# Altium schematic sheet Dynamics_Sch.SchDoc
size A3; SheetNumber: 1; SheetTotal: 4
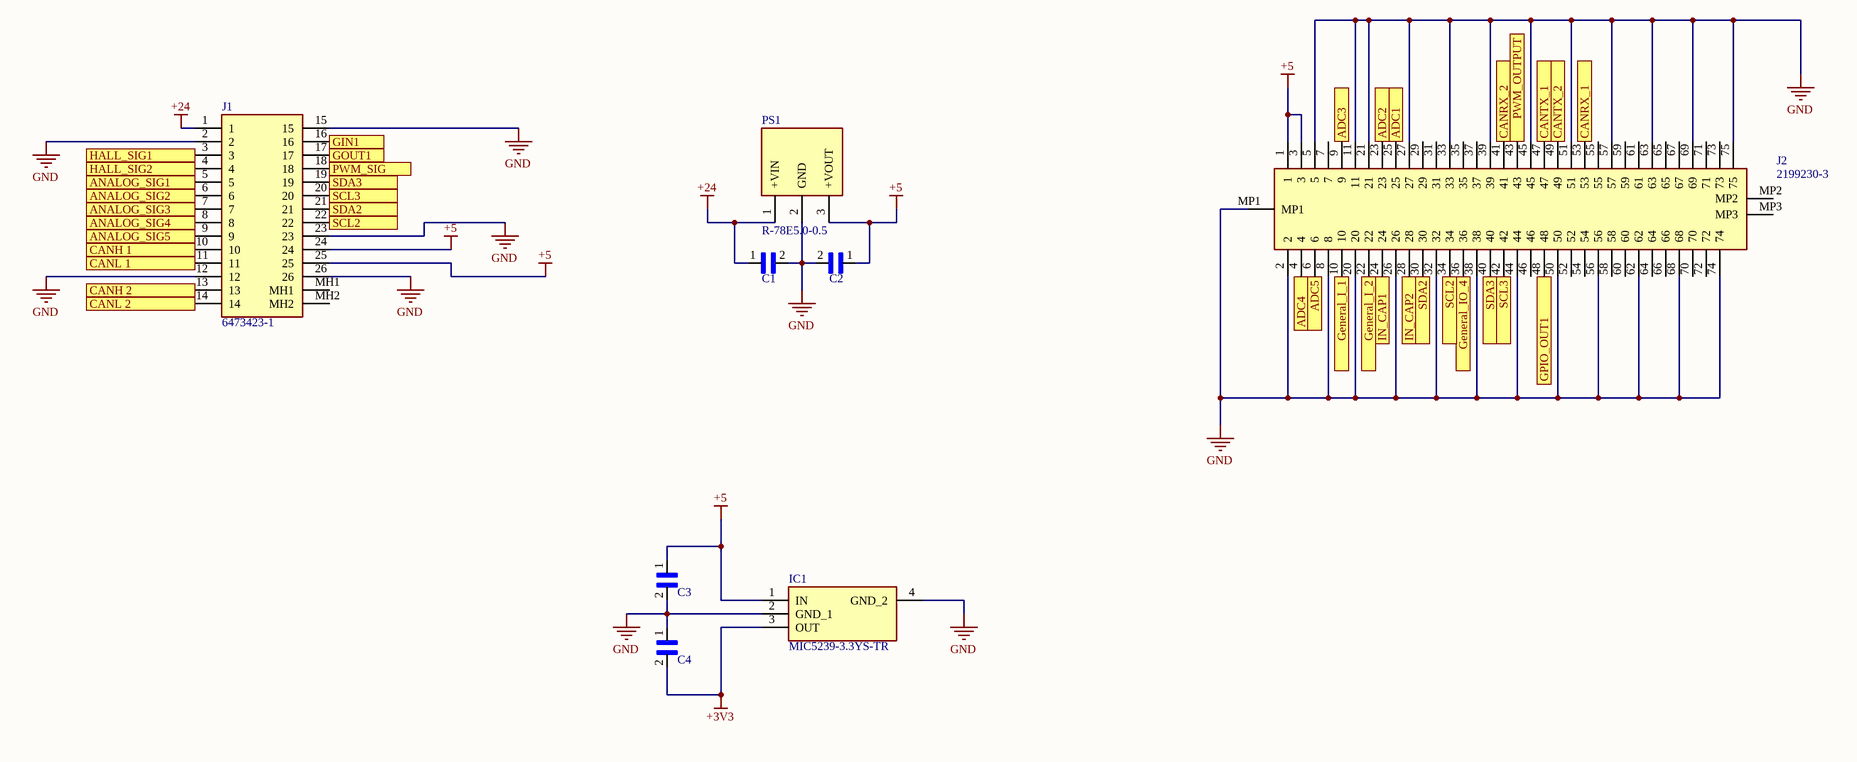
[diagram p0: Dynamics_Sch.SchDoc]

## Parts
C1  0805_Capacitor  [0805_Capacitor]  (value not drawn)
C2  0805_Capacitor  [0805_Capacitor]  (value not drawn)
C3  0805_Capacitor  [0805_Capacitor]  (value not drawn)
C4  0805_Capacitor  [0805_Capacitor]  (value not drawn)
IC1  MIC5239-3.3YS-TR  [SOT230P700X180-4N]
J1  6473423-1  [CONN26_6473423-1_TEC]
J2  2199230-3  [21992303]
PS1  R-78E5.0-0.5  [R78E5005]

## Ports
ADC1 (see Analog_Circuit[2A]), ADC2 (see Analog_Circuit[1C]), ADC3 (see Analog_Circuit[1D]), ADC4 (see Analog_Circuit[3A]), ADC5 (see Analog_Circuit[3B]), ANALOG_SIG1 (see Analog_Circuit[1A]), ANALOG_SIG2 (see Analog_Circuit[1C]), ANALOG_SIG3 (see Analog_Circuit[1D]), ANALOG_SIG4 (see Analog_Circuit[2A]), ANALOG_SIG5 (see Analog_Circuit[2B]), CANH 1 (see Communication[2A]), CANH 2 (see Communication[2B]), CANL 1 (see Communication[2A]), CANL 2 (see Communication[2B]), CANRX_1 (see Communication[2A]), CANRX_2 (see Communication[2B]), CANTX_1 (see Communication[2A]), CANTX_2 (see Communication[2B]), General_I_1 (see Analog_Circuit_1[1A]), General_I_2, General_IO_4, GIN1 (see Analog_Circuit_1[1A]), GOUT1 (see Analog_Circuit_1[2C]), GPIO_OUT1 (see Analog_Circuit_1[1C]), HALL_SIG1 (see Analog_Circuit[3B]), HALL_SIG2 (see Analog_Circuit[3C]), IN_CAP1 (see Analog_Circuit[4A]), IN_CAP2 (see Analog_Circuit[4C]), PWM_OUTPUT (see Analog_Circuit[2D]), PWM_SIG (see Analog_Circuit[3C]), SCL2 (see Dynamics_Sch[2B]), SCL2 (see Dynamics_Sch[7B]), SCL3 (see Dynamics_Sch[2B]), SCL3 (see Dynamics_Sch[7B]), SDA2 (see Dynamics_Sch[2B]), SDA2 (see Dynamics_Sch[6B]), SDA3 (see Dynamics_Sch[2B]), SDA3 (see Dynamics_Sch[7B])

## Nets
+3V3: C4.2 IC1.3(OUT)
+5: C2.1 C3.1 IC1.1(IN) J1.24 J1.25 J2.1 J2.3 PS1.3(+VOUT)
+24: C1.1 J1.1 PS1.1(+VIN)
GND: C1.2 C2.2 C3.2 C4.1 IC1.2(GND_1) IC1.4(GND_2) J1.2 J1.12 J1.15 J1.23 J1.26 J2.2 J2.5 J2.8 J2.11 J2.20 J2.21 J2.26 J2.27 J2.32 J2.33 J2.38 J2.39 J2.44 J2.45 J2.50 J2.51 J2.56 J2.57 J2.62 J2.63 J2.68 J2.69 J2.74 J2.75 J2.MP1 PS1.2(GND)
ADC1: J2.25 ; port ADC1
ADC2: J2.23 ; port ADC2
ADC3: J2.9 ; port ADC3
ADC4: J2.4 ; port ADC4
ADC5: J2.6 ; port ADC5
ANALOG_SIG1: J1.5 ; port ANALOG_SIG1
ANALOG_SIG2: J1.6 ; port ANALOG_SIG2
ANALOG_SIG3: J1.7 ; port ANALOG_SIG3
ANALOG_SIG4: J1.8 ; port ANALOG_SIG4
ANALOG_SIG5: J1.9 ; port ANALOG_SIG5
CANH 1: J1.10 ; port CANH 1
CANH 2: J1.13 ; port CANH 2
CANL 1: J1.11 ; port CANL 1
CANL 2: J1.14 ; port CANL 2
CANRX_1: J2.53 ; port CANRX_1
CANRX_2: J2.41 ; port CANRX_2
CANTX_1: J2.47 ; port CANTX_1
CANTX_2: J2.49 ; port CANTX_2
General_I_1: J2.10 ; port General_I_1
General_I_2: J2.22 ; port General_I_2
General_IO_4: J2.36 ; port General_IO_4
GIN1: J1.16 ; port GIN1
GOUT1: J1.17 ; port GOUT1
GPIO_OUT1: J2.48 ; port GPIO_OUT1
HALL_SIG1: J1.3 ; port HALL_SIG1
HALL_SIG2: J1.4 ; port HALL_SIG2
IN_CAP1: J2.24 ; port IN_CAP1
IN_CAP2: J2.28 ; port IN_CAP2
PWM_OUTPUT: J2.43 ; port PWM_OUTPUT
PWM_SIG: J1.18 ; port PWM_SIG
SCL2: J1.22 J2.34 ; port SCL2
SCL3: J1.20 J2.42 ; port SCL3
SDA2: J1.21 J2.30 ; port SDA2
SDA3: J1.19 J2.40 ; port SDA3

Not connected (* = marked no-connect by the designer): J1 MH1 MH2; J2 7 29 31 35 37 46 52 54 55 58 59 60 61 64 65 66 67 70 71 72 73 MP2 MP3

## Library data of the parts
C1-C4 = 0805_Capacitor: MP: CL21B104KBCNNNC; MF: Samsung; Availability: Unavailable; Package: 0805 Samsung; Value: *; Price: None; SnapEDA_Link: https://www.snapeda.com/parts/CL21B104KBCNNNC/Samsung/view-part/3597943/?ref=snap
IC1 = MIC5239-3.3YS-TR: Integrated Circuit; Manufacturer_Name: Microchip; Datasheet Link: https://ww1.microchip.com/downloads/en/DeviceDoc/mic5239.pdf; Height: 1.8mm; Manufacturer_Part_Number: MIC5239-3.3YS-TR; Mouser Part Number: 998-MIC5239-3.3YSTR; Mouser Price/Stock: https://www.mouser.co.uk/ProductDetail/Microchip-Technology-Micrel/MIC5239-33YS-TR?qs=U6T8BxXiZAXN0UitWWB92A%3D%3D; Arrow Part Number: MIC5239-3.3YS-TR; Arrow Price/Stock: https://www.arrow.com/en/products/mic5239-3.3ys-tr/microchip-technology?region=nac
J1 = 6473423-1: Connector; Manufacturer_Name: TE Connectivity; Datasheet Link: https://www.te.com/commerce/DocumentDelivery/DDEController?Action=showdoc&DocId=Customer+Drawing%7F9-1437287-8%7FA1%7Fpdf%7FEnglish%7FENG_CD_9-1437287-8_A1.pdf%7F6473423-1; Height: 27.9mm; Manufacturer_Part_Number: 6473423-1; Mouser Part Number: 571-6473423-1; Mouser Price/Stock: https://www.mouser.co.uk/ProductDetail/TE-Connectivity/6473423-1?qs=XhI5AayaxxW9FyxB9N39mQ%3D%3D
J2 = 2199230-3: Connector; Manufacturer_Name: TE Connectivity; Datasheet Link: https://componentsearchengine.com/Datasheets/2/2199230-3.pdf; Height: 4.2mm; Manufacturer_Part_Number: 2199230-3; Mouser Part Number: 571-2199230-3; Mouser Price/Stock: https://www.mouser.co.uk/ProductDetail/TE-Connectivity/2199230-3?qs=EQCnRgr4b6HElQOKr5ma1Q%3D%3D; Arrow Part Number: 2199230-3; Arrow Price/Stock: https://www.arrow.com/en/products/2199230-3/te-connectivity?region=nac
PS1 = R-78E5.0-0.5: Power Supply; Manufacturer_Name: RECOM Power; Datasheet Link: https://datasheet.datasheetarchive.com/originals/distributors/Datasheets_SAMA/1560217c2d38d5ce10907af13420fc49.pdf; Height: 10.9mm; Manufacturer_Part_Number: R-78E5.0-0.5; Mouser Part Number: 919-R-78E5.0-0.5; Mouser Price/Stock: https://www.mouser.co.uk/ProductDetail/RECOM-Power/R-78E5.0-0.5?qs=JeAkOuORR2UvBuiB2kZVZQ%3D%3D; Arrow Part Number: R-78E5.0-0.5; Arrow Price/Stock: https://www.arrow.com/en/products/r-78e5.0-0.5/recom-power?region=europe